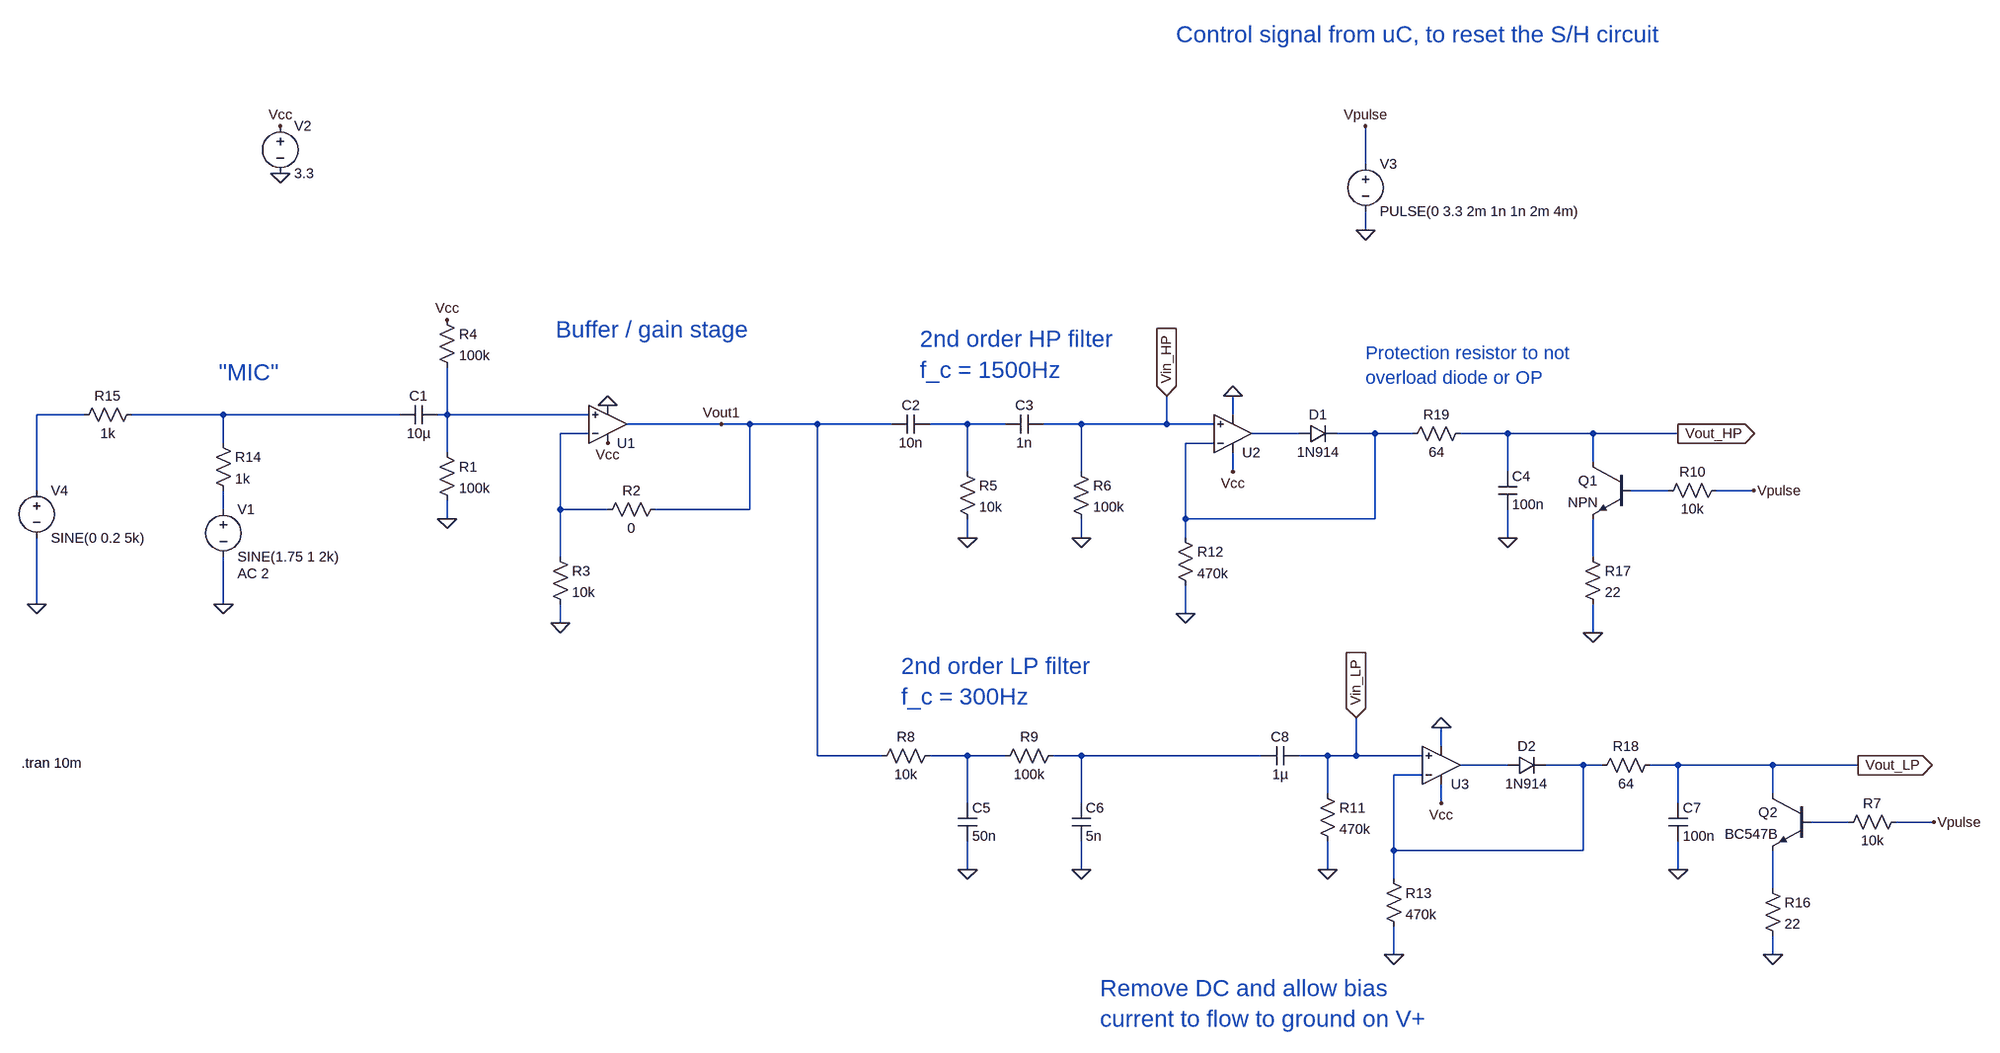
[diagram p0: schematic Audio peak detector with filter.asc]
Audio peak detector with filter.asc, the LTspice schematic file:
Version 4
SHEET 1 2988 1220
WIRE 1568 -336 1568 -400
WIRE 1568 -224 1568 -256
WIRE -736 144 -816 144
WIRE -464 144 -656 144
WIRE -128 144 -464 144
WIRE -48 144 -48 64
WIRE -48 144 -64 144
WIRE 208 144 -48 144
WIRE 1344 144 1344 112
WIRE 432 160 272 160
WIRE 480 160 432 160
WIRE 624 160 480 160
WIRE 768 160 624 160
WIRE 896 160 832 160
WIRE 960 160 896 160
WIRE 1088 160 1024 160
WIRE 1232 160 1232 112
WIRE 1232 160 1088 160
WIRE 1312 160 1232 160
WIRE 208 176 160 176
WIRE 1456 176 1376 176
WIRE 1584 176 1520 176
WIRE 1648 176 1584 176
WIRE 1808 176 1728 176
WIRE 1952 176 1808 176
WIRE 2096 176 1952 176
WIRE -464 192 -464 144
WIRE 1312 192 1264 192
WIRE -48 208 -48 144
WIRE 1952 224 1952 176
WIRE 896 240 896 160
WIRE 1088 240 1088 160
WIRE 1344 240 1344 208
WIRE 1808 240 1808 176
WIRE -816 272 -816 144
WIRE 2080 272 2016 272
WIRE 2224 272 2160 272
WIRE -464 304 -464 272
WIRE 160 304 160 176
WIRE 240 304 160 304
WIRE 480 304 480 160
WIRE 480 304 320 304
WIRE -48 320 -48 288
WIRE 1264 320 1264 192
WIRE 1584 320 1584 176
WIRE 1584 320 1264 320
WIRE 896 352 896 320
WIRE 1088 352 1088 320
WIRE 1264 352 1264 320
WIRE 1808 352 1808 304
WIRE 160 384 160 304
WIRE 1952 384 1952 320
WIRE -816 464 -816 352
WIRE -464 464 -464 384
WIRE 1264 480 1264 432
WIRE 160 496 160 464
WIRE 1952 512 1952 464
WIRE 1696 704 1696 672
WIRE 624 720 624 160
WIRE 752 720 624 720
WIRE 896 720 832 720
WIRE 960 720 896 720
WIRE 1088 720 1040 720
WIRE 1392 720 1088 720
WIRE 1504 720 1456 720
WIRE 1552 720 1552 656
WIRE 1552 720 1504 720
WIRE 1664 720 1552 720
WIRE 1808 736 1728 736
WIRE 1936 736 1872 736
WIRE 1968 736 1936 736
WIRE 2096 736 2048 736
WIRE 2256 736 2096 736
WIRE 2400 736 2256 736
WIRE 1664 752 1616 752
WIRE 1504 784 1504 720
WIRE 2256 784 2256 736
WIRE 896 800 896 720
WIRE 1088 800 1088 720
WIRE 1696 800 1696 768
WIRE 2096 800 2096 736
WIRE 2384 832 2320 832
WIRE 2528 832 2464 832
WIRE 1616 880 1616 752
WIRE 1936 880 1936 736
WIRE 1936 880 1616 880
WIRE 896 912 896 864
WIRE 1088 912 1088 864
WIRE 1504 912 1504 864
WIRE 2096 912 2096 864
WIRE 1616 928 1616 880
WIRE 2256 944 2256 880
WIRE 1616 1056 1616 1008
WIRE 2256 1056 2256 1024
FLAG 160 496 0
FLAG -48 320 0
FLAG -464 464 0
FLAG -368 -320 0
FLAG -368 -400 Vcc
FLAG -48 -16 Vcc
FLAG 240 192 Vcc
FLAG 240 128 0
FLAG 432 160 Vout1
FLAG 896 352 0
FLAG 1088 352 0
FLAG 1344 240 Vcc
FLAG 1344 112 0
FLAG 1808 352 0
FLAG 896 912 0
FLAG 1088 912 0
FLAG 1696 800 Vcc
FLAG 1696 672 0
FLAG 2096 912 0
FLAG 1504 912 0
FLAG 1616 1056 0
FLAG 1264 480 0
FLAG 2096 176 Vout_HP
IOPIN 2096 176 Out
FLAG 2400 736 Vout_LP
IOPIN 2400 736 Out
FLAG 1568 -224 0
FLAG 1568 -400 Vpulse
FLAG 2528 832 Vpulse
FLAG 2224 272 Vpulse
FLAG -816 464 0
FLAG 1552 656 Vin_LP
IOPIN 1552 656 In
FLAG 1232 112 Vin_HP
IOPIN 1232 112 In
FLAG 2256 1056 0
FLAG 1952 512 0
SYMBOL OpAmps\\UniversalOpAmp2 240 160 M180
SYMATTR InstName U1
SYMBOL cap -64 128 R90
WINDOW 0 0 32 VBottom 2
WINDOW 3 32 32 VTop 2
SYMATTR InstName C1
SYMATTR Value 10µ
SYMBOL res -64 192 R0
SYMATTR InstName R1
SYMATTR Value 100k
SYMBOL res 224 320 R270
WINDOW 0 32 56 VTop 2
WINDOW 3 0 56 VBottom 2
SYMATTR InstName R2
SYMATTR Value 0
SYMBOL res 144 368 R0
SYMATTR InstName R3
SYMATTR Value 10k
SYMBOL res -64 -32 R0
SYMATTR InstName R4
SYMATTR Value 100k
SYMBOL voltage -464 288 R0
WINDOW 123 24 124 Left 2
WINDOW 39 0 0 Left 0
SYMATTR Value2 AC 2
SYMATTR InstName V1
SYMATTR Value SINE(1.75 1 2k)
SYMBOL voltage -368 -416 R0
WINDOW 123 0 0 Left 0
WINDOW 39 0 0 Left 0
SYMATTR InstName V2
SYMATTR Value 3.3
SYMBOL cap 832 144 R90
WINDOW 0 0 32 VBottom 2
WINDOW 3 32 32 VTop 2
SYMATTR InstName C2
SYMATTR Value 10n
SYMBOL res 880 224 R0
SYMATTR InstName R5
SYMATTR Value 10k
SYMBOL cap 1024 144 R90
WINDOW 0 0 32 VBottom 2
WINDOW 3 32 32 VTop 2
SYMATTR InstName C3
SYMATTR Value 1n
SYMBOL res 1072 224 R0
SYMATTR InstName R6
SYMATTR Value 100k
SYMBOL OpAmps\\UniversalOpAmp2 1344 176 M180
SYMATTR InstName U2
SYMBOL diode 1456 192 R270
WINDOW 0 32 32 VTop 2
WINDOW 3 0 32 VBottom 2
SYMATTR InstName D1
SYMATTR Value 1N914
SYMBOL OpAmps\\UniversalOpAmp2 1696 736 M180
SYMATTR InstName U3
SYMBOL diode 1808 752 R270
WINDOW 0 32 32 VTop 2
WINDOW 3 0 32 VBottom 2
SYMATTR InstName D2
SYMATTR Value 1N914
SYMBOL res 848 704 R90
WINDOW 0 0 56 VBottom 2
WINDOW 3 32 56 VTop 2
SYMATTR InstName R8
SYMATTR Value 10k
SYMBOL res 1056 704 R90
WINDOW 0 0 56 VBottom 2
WINDOW 3 32 56 VTop 2
SYMATTR InstName R9
SYMATTR Value 100k
SYMBOL cap 880 800 R0
SYMATTR InstName C5
SYMATTR Value 50n
SYMBOL cap 1072 800 R0
SYMATTR InstName C6
SYMATTR Value 5n
SYMBOL cap 1456 704 R90
WINDOW 0 0 32 VBottom 2
WINDOW 3 32 32 VTop 2
SYMATTR InstName C8
SYMATTR Value 1µ
SYMBOL res 1488 768 R0
SYMATTR InstName R11
SYMATTR Value 470k
SYMBOL cap 1792 240 R0
SYMATTR InstName C4
SYMATTR Value 100n
SYMBOL cap 2080 800 R0
SYMATTR InstName C7
SYMATTR Value 100n
SYMBOL res 1248 336 R0
SYMATTR InstName R12
SYMATTR Value 470k
SYMBOL res 1600 912 R0
SYMATTR InstName R13
SYMATTR Value 470k
SYMBOL npn 2016 224 M0
SYMATTR InstName Q1
SYMBOL npn 2320 784 M0
SYMATTR InstName Q2
SYMATTR Value BC547B
SYMBOL voltage 1568 -352 R0
WINDOW 123 0 0 Left 0
WINDOW 39 0 0 Left 0
SYMATTR InstName V3
SYMATTR Value PULSE(0 3.3 2m 1n 1n 2m 4m)
SYMBOL res 2480 816 R90
WINDOW 0 0 56 VBottom 2
WINDOW 3 32 56 VTop 2
SYMATTR InstName R7
SYMATTR Value 10k
SYMBOL res 2176 256 R90
WINDOW 0 0 56 VBottom 2
WINDOW 3 32 56 VTop 2
SYMATTR InstName R10
SYMATTR Value 10k
SYMBOL res -480 176 R0
SYMATTR InstName R14
SYMATTR Value 1k
SYMBOL res -640 128 R90
WINDOW 0 0 56 VBottom 2
WINDOW 3 32 56 VTop 2
SYMATTR InstName R15
SYMATTR Value 1k
SYMBOL voltage -816 256 R0
WINDOW 123 0 0 Left 0
WINDOW 39 0 0 Left 0
SYMATTR InstName V4
SYMATTR Value SINE(0 0.2 5k)
SYMBOL res 2240 928 R0
SYMATTR InstName R16
SYMATTR Value 22
SYMBOL res 1936 368 R0
SYMATTR InstName R17
SYMATTR Value 22
SYMBOL res 2064 720 R90
WINDOW 0 0 56 VBottom 2
WINDOW 3 32 56 VTop 2
SYMATTR InstName R18
SYMATTR Value 64
SYMBOL res 1744 160 R90
WINDOW 0 0 56 VBottom 2
WINDOW 3 32 56 VTop 2
SYMATTR InstName R19
SYMATTR Value 64
TEXT 152 0 Left 4 ;Buffer / gain stage
TEXT -472 72 Left 4 ;"MIC"
TEXT 784 568 Left 4 ;2nd order LP filter\nf_c = 300Hz
TEXT 1120 1112 Left 4 ;Remove DC and allow bias\ncurrent to flow to ground on V+
TEXT 816 16 Left 4 ;2nd order HP filter\nf_c = 1500Hz
TEXT 1248 -560 Left 4 ;Control signal from uC, to reset the S/H circuit
TEXT 1568 40 Left 3 ;Protection resistor to not\noverload diode or OP
TEXT -842 732 Left 2 !.tran 10m

The netlist it stands for:
* Audio peak detector with filter.asc
XU1 N003 N005 Vcc 0 Vout1 level2 Avol=1Meg GBW=10Meg Slew=10Meg Ilimit=25m Rail=0 Vos=0 En=0 Enk=0 In=0 Ink=0 Rin=500Meg  ; pins In+ In- V+ V- OUT
C1 N003 N002 10µ
R1 N003 0 100k
R2 N005 Vout1 0
R3 N005 0 10k
R4 Vcc N003 100k
V1 N009 0 SINE(1.75 1 2k) AC 2
V2 Vcc 0 3.3
C2 N004 Vout1 10n
R5 N004 0 10k
C3 Vin_HP N004 1n
R6 Vin_HP 0 100k
XU2 Vin_HP N007 Vcc 0 N006 level2 Avol=1Meg GBW=10Meg Slew=10Meg Ilimit=25m Rail=0 Vos=0 En=0 Enk=0 In=0 Ink=0 Rin=500Meg  ; pins In+ In- V+ V- OUT
D1 N006 N007 1N914
XU3 Vin_LP N014 Vcc 0 N013 level2 Avol=1Meg GBW=10Meg Slew=10Meg Ilimit=25m Rail=0 Vos=0 En=0 Enk=0 In=0 Ink=0 Rin=500Meg  ; pins In+ In- V+ V- OUT
D2 N013 N014 1N914
R8 N011 Vout1 10k
R9 N012 N011 100k
C5 N011 0 50n
C6 N012 0 5n
C8 Vin_LP N012 1µ
R11 Vin_LP 0 470k
C4 Vout_HP 0 100n
C7 Vout_LP 0 100n
R12 N007 0 470k
R13 N014 0 470k
Q1 Vout_HP N008 N010 0 NPN
Q2 Vout_LP N015 N016 0 BC547B
V3 Vpulse 0 PULSE(0 3.3 2m 1n 1n 2m 4m)
R7 Vpulse N015 10k
R10 Vpulse N008 10k
R14 N002 N009 1k
R15 N002 N001 1k
V4 N001 0 SINE(0 0.2 5k)
R16 N016 0 22
R17 N010 0 22
R18 Vout_LP N014 64
R19 Vout_HP N007 64
.model D D
.lib standard.dio
.model NPN NPN
.model PNP PNP
.lib standard.bjt
* Buffer / gain stage
* "MIC"
* 2nd order LP filter
* f_c = 300Hz
* Remove DC and allow bias
* current to flow to ground on V+
* 2nd order HP filter
* f_c = 1500Hz
* Control signal from uC, to reset the S/H circuit
* Protection resistor to not
* overload diode or OP
.tran 10m
.lib UniversalOpAmp2.lib
.backanno
.end